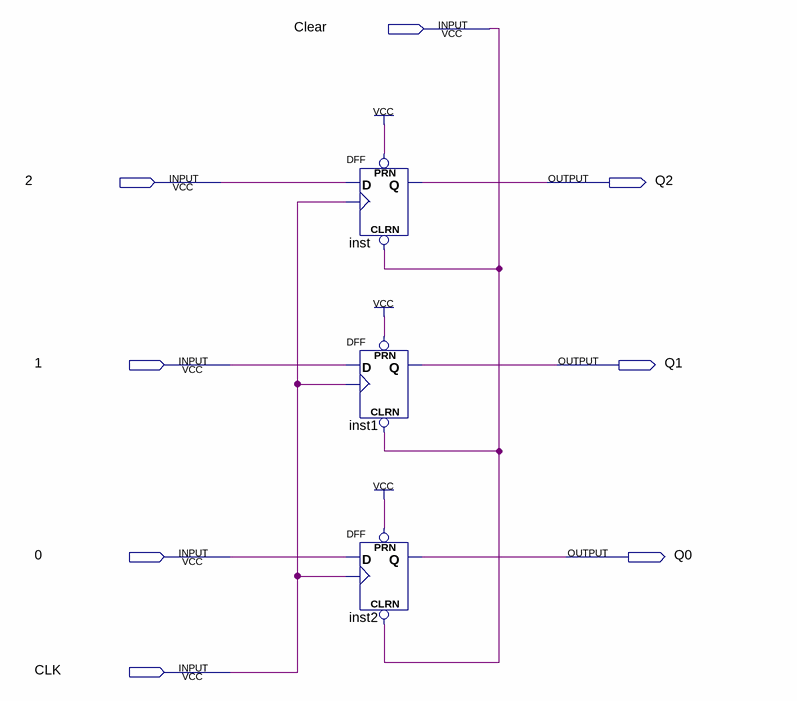
[diagram p0: schematic sheet]
// Quartus schematic 3bitRegister.bdf as structural Verilog: 3 symbols, 8 pins
module \3bitRegister  (
  input  Clear,
  input  \2 ,
  input  \1 ,
  input  \0 ,
  input  CLK,
  output Q2,
  output Q1,
  output Q0
);

  DFF inst (.CLRN(Clear), .CLK(CLK), .D(\2 ), .PRN(1'b1), .Q(Q2));
  DFF inst1 (.CLRN(Clear), .CLK(CLK), .D(\1 ), .PRN(1'b1), .Q(Q1));
  DFF inst2 (.CLRN(Clear), .CLK(CLK), .D(\0 ), .PRN(1'b1), .Q(Q0));
endmodule
